# Altium schematic sheet PMIC.SchDoc
size A3; SheetNumber: 5; SheetTotal: 6
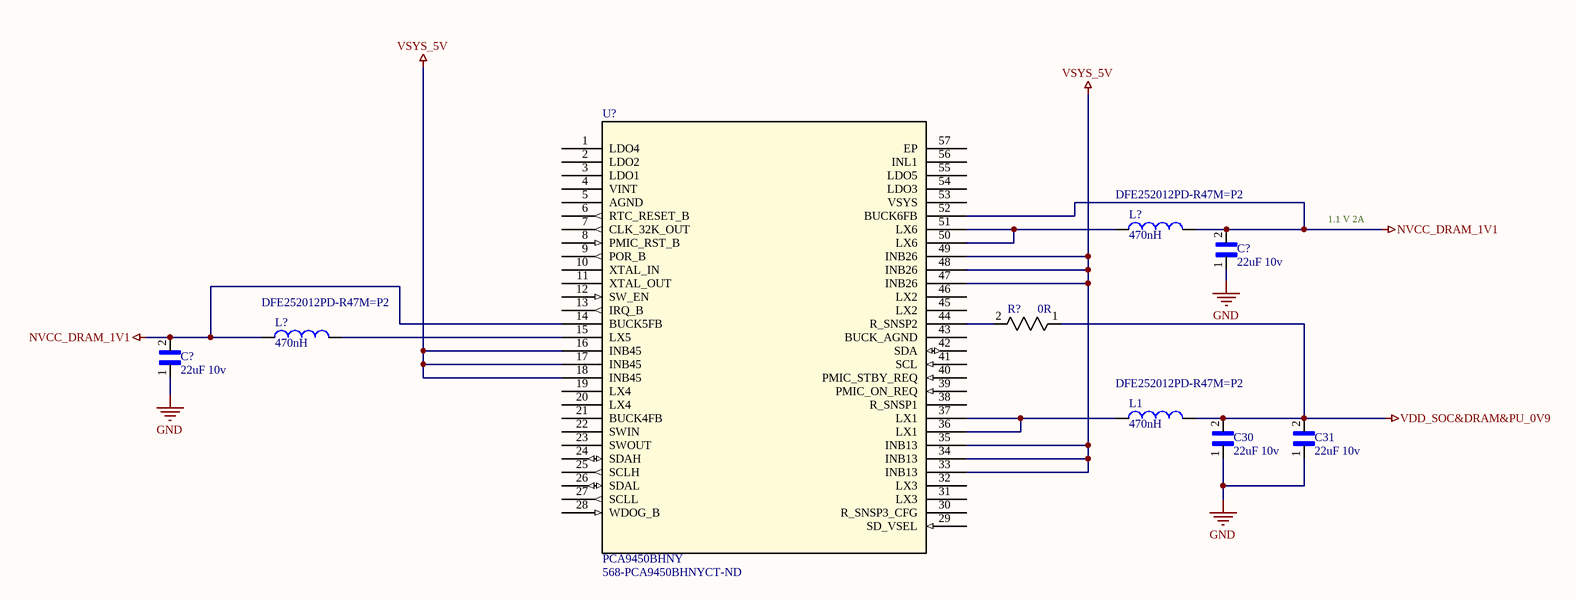
[diagram p0: PMIC.SchDoc]

## Parts
(Parts that share a designator on the sheet are numbered #1, #2 ... from top to bottom, then left to right.)
C30  22uF 10v  [CAPC1608X100N]
C31  22uF 10v  [CAPC1608X100N]
C?#1  22uF 10v  [CAPC1608X100N]
C?#2  22uF 10v  [CAPC1608X100N]
L1  DFE252012PD-R47M=P2  Inductance: 470nH  [IND-SMD_L2.5-W2.0_SWPA252012S]
L?#1  DFE252012PD-R47M=P2  Inductance: 470nH  [IND-SMD_L2.5-W2.0_SWPA252012S]
L?#2  DFE252012PD-R47M=P2  Inductance: 470nH  [IND-SMD_L2.5-W2.0_SWPA252012S]
R?  0R  [RC0402X]
U?  PCA9450BHNY  Supplier Part Number 1: 568-PCA9450BHNYCT-ND  [HVQFN56_SOT949-6_NXP]

## Nets
GND: C30.1 C31.1 C?#1.1 C?#2.1
NVCC_DRAM_1V1: C?#1.2 C?#2.2 L?#1.2 L?#2.1 U?.14(BUCK5FB) U?.52(BUCK6FB)
VDD_SOC&DRAM&PU_0V9: C30.2 C31.2 L1.2 R?.1
VSYS_5V: U?.16(INB45) U?.17(INB45) U?.18(INB45) U?.33(INB13) U?.34(INB13) U?.35(INB13) U?.47(INB26) U?.48(INB26) U?.49(INB26)
NetL1_1: L1.1 U?.36(LX1) U?.37(LX1)
NetL?#1_1: L?#1.1 U?.50(LX6) U?.51(LX6)
NetL?#2_2: L?#2.2 U?.15(LX5)
NetR?_2: R?.2 U?.44(R_SNSP2)

Not connected (* = marked no-connect by the designer): U? 1(LDO4) 2(LDO2) 3(LDO1) 4(VINT) 5(AGND) 6(RTC_RESET_B) 7(CLK_32K_OUT) 8(PMIC_RST_B) 9(POR_B) 10(XTAL_IN) 11(XTAL_OUT) 12(SW_EN) 13(IRQ_B) 19(LX4) 20(LX4) 21(BUCK4FB) 22(SWIN) 23(SWOUT) 24(SDAH) 25(SCLH) 26(SDAL) 27(SCLL) 28(WDOG_B) 29(SD_VSEL) 30(R_SNSP3_CFG) 31(LX3) 32(LX3) 38(R_SNSP1) 39(PMIC_ON_REQ) 40(PMIC_STBY_REQ) 41(SCL) 42(SDA) 43(BUCK_AGND) 45(LX2) 46(LX2) 53(VSYS) 54(LDO3) 55(LDO5) 56(INL1) 57(EP)

## Notes on the sheet
- 1.1 V 2A

## Library data of the parts
C30 C31 C?#1 C?#2 = GRM188R61A226ME15D: SMD Capacitor X5R(EIA) with Capacitance: 22uF Tol. 20%. Rated Voltage: 10Vdc; Value: *; Availability: Unavailable; Package: None; MP: GRM188R61A226ME15D; Price: None
L1 L?#1 L?#2 = DFE252012PD-R47M=P2: Inductor Power Shielded Wirewound 0.47uH 20% 1MHz Metal 4A 0.027Ohm DCR 1008 Automotive T/R; Manufacturer: Murata; Saturation Current: 5.2A; Series Resistance: 27mR; Supplier 1: Digikey; RoHS: Yes; Category: Fixed Inductors; Stock 1: 54000; Pricing 1: 3000=0.20501, 6000=0.19333, 9000=0.18681, 15000=0.17892, 21000=0.17392, 30000=0.16876 (USD); Min Operating Temperature: -40°C; Max Operating Temperature: 125°C; Inductance Tolerance: 20%; RMS Current (Irms): 4A; Test Frequency: 1MHz; Tolerance: 20%; RoHS Compliant: Yes; ComponentLink1URL: http://www.farnell.com/datasheets/2616814.pdf?src-supplier=Farnell; ComponentLink1Description: http://www.farnell.com/datasheets/2616814.pdf?src-supplier=Farnell; ComponentLink2URL: https://search.murata.co.jp/Ceramy/image/img/P02/J(E)TE243A-9102.pdf?src-supplier=Digikey; ComponentLink2Description: https://search.murata.co.jp/Ceramy/image/img/P02/J(E)TE243A-9102.pdf?src-supplier=Digikey; ComponentLink3URL: http://www.farnell.com/datasheets/2616814.pdf?src-supplier=Newark; ComponentLink3Description: http://www.farnell.com/datasheets/2616814.pdf?src-supplier=Newark; Supplier Part Number 1: 490-DFE252012PD-R47M=P2TR-ND; Current Rating: 4A; Manufacturer Part Number: DFE252012PD-R47M=P2; Height: 1.2mm
R? = CR0402AJ/-000GAS: Zero Ohm Resistor, Jumper, 0402 [1005 Metric], Thick Film, 63 mW, 1 A, Surface Mount; Manufacturer: Bourns; Max Power Dissipation: 63mW; Temperature Coefficient: 500ppm/°C; Voltage Rating (DC): 50V; Supplier 1: Digikey; Manufacturer Part Number: CR0402AJ/-000GAS; RoHS: Yes; Category: Chip SMD Resistors; Stock 1: 124642; Pricing 1: 1=0.1, 10=0.024, 50=0.0144, 100=0.0117, 500=0.00752, 1000=0.00635, 5000=0.00451 (USD); Case/Package: 0402; Case Code (Imperial): 0402; Case Code (Metric): 1005; Min Operating Temperature: -55°C; Max Operating Temperature: 155°C; Features: Moisture Resistant,Automotive AEC-Q200,Anti-Sulfur; Series: CR0402A-AS; Packaging: Cut Tape; Resistance: 0R; Number of Terminations: 2; Power Rating: 63mW; Ratings: AEC-Q200; ComponentLink1URL: https://www.bourns.com/docs/product-datasheets/crxxxxa-as.pdf?src-supplier=Digikey; ComponentLink1Description: https://www.bourns.com/docs/product-datasheets/crxxxxa-as.pdf?src-supplier=Digikey; Supplier Part Number 1: CR0402AJ/-000GASCT-ND
U? = PCA9450BHNY: Power Manage Ic (Pmic) For I.mx 8M Nano Rohs Compliant: Yes |Nxp PCA9450BHNY; Manufacturer: NXP Semiconductors; Supplier 1: Digikey; Manufacturer Part Number: PCA9450BHNY; RoHS: No; Category: Power Management ICs; Stock 1: 7995; Pricing 1: 1=5.66, 10=4.331, 25=3.9992, 100=3.6339, 250=3.45972, 500=3.35474, 1000=3.26833 (USD); RoHS Compliant: Yes; ComponentLink1URL: https://datasheet.octopart.com/PCA9450BHNY-NXP-Semiconductors-datasheet-150009921.pdf?src-supplier=Future+Electronics; ComponentLink1Description: https://datasheet.octopart.com/PCA9450BHNY-NXP-Semiconductors-datasheet-150009921.pdf?src-supplier=Future+Electronics